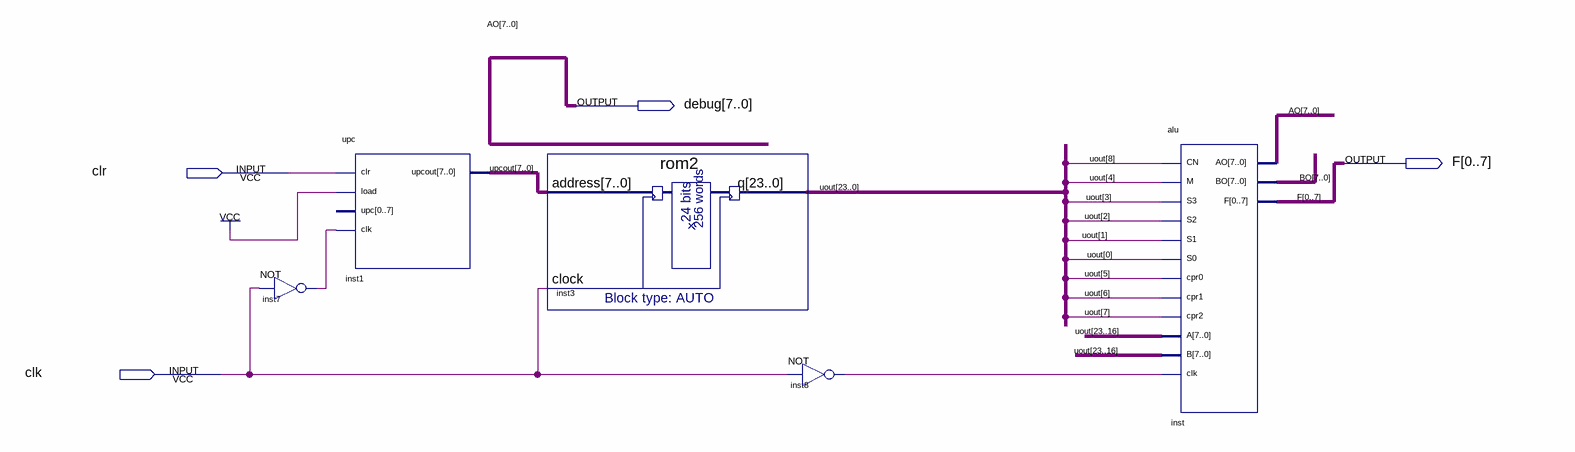
[diagram p0: schematic sheet]
// Quartus schematic 1.bdf as structural Verilog: 5 symbols, 4 pins
module \1  (
  input  clr,
  input  clk,
  output [7:0] debug,
  output [0:7] F
);

  wire inst7_out, inst8_out;
  wire [7:0] BO, upcout;
  wire [23:0] uout;

  not inst7 (inst7_out, clk);
  upc inst1 (.clr(clr), .load(1'b1), .clk(inst7_out), .upcout(upcout));  // open: upc
  rom2 inst3 (.address(upcout), .clock(clk), .q(uout));
  not inst8 (inst8_out, clk);
  alu inst (
    .CN(uout[8]), .M(uout[4]), .S3(uout[3]), .S2(uout[2]), .S1(uout[1]), .S0(uout[0]), .cpr0(uout[5]),
    .cpr1(uout[6]), .cpr2(uout[7]), .A(uout[23:16]), .B(uout[23:16]), .clk(inst8_out), .AO(debug), .BO(BO),
    .F(F));

  // Other names for the same wires on the sheet: AO[7:0] = debug
endmodule
